# EAGLE design W5100_ethernet_shield (EAGLE 6.1)
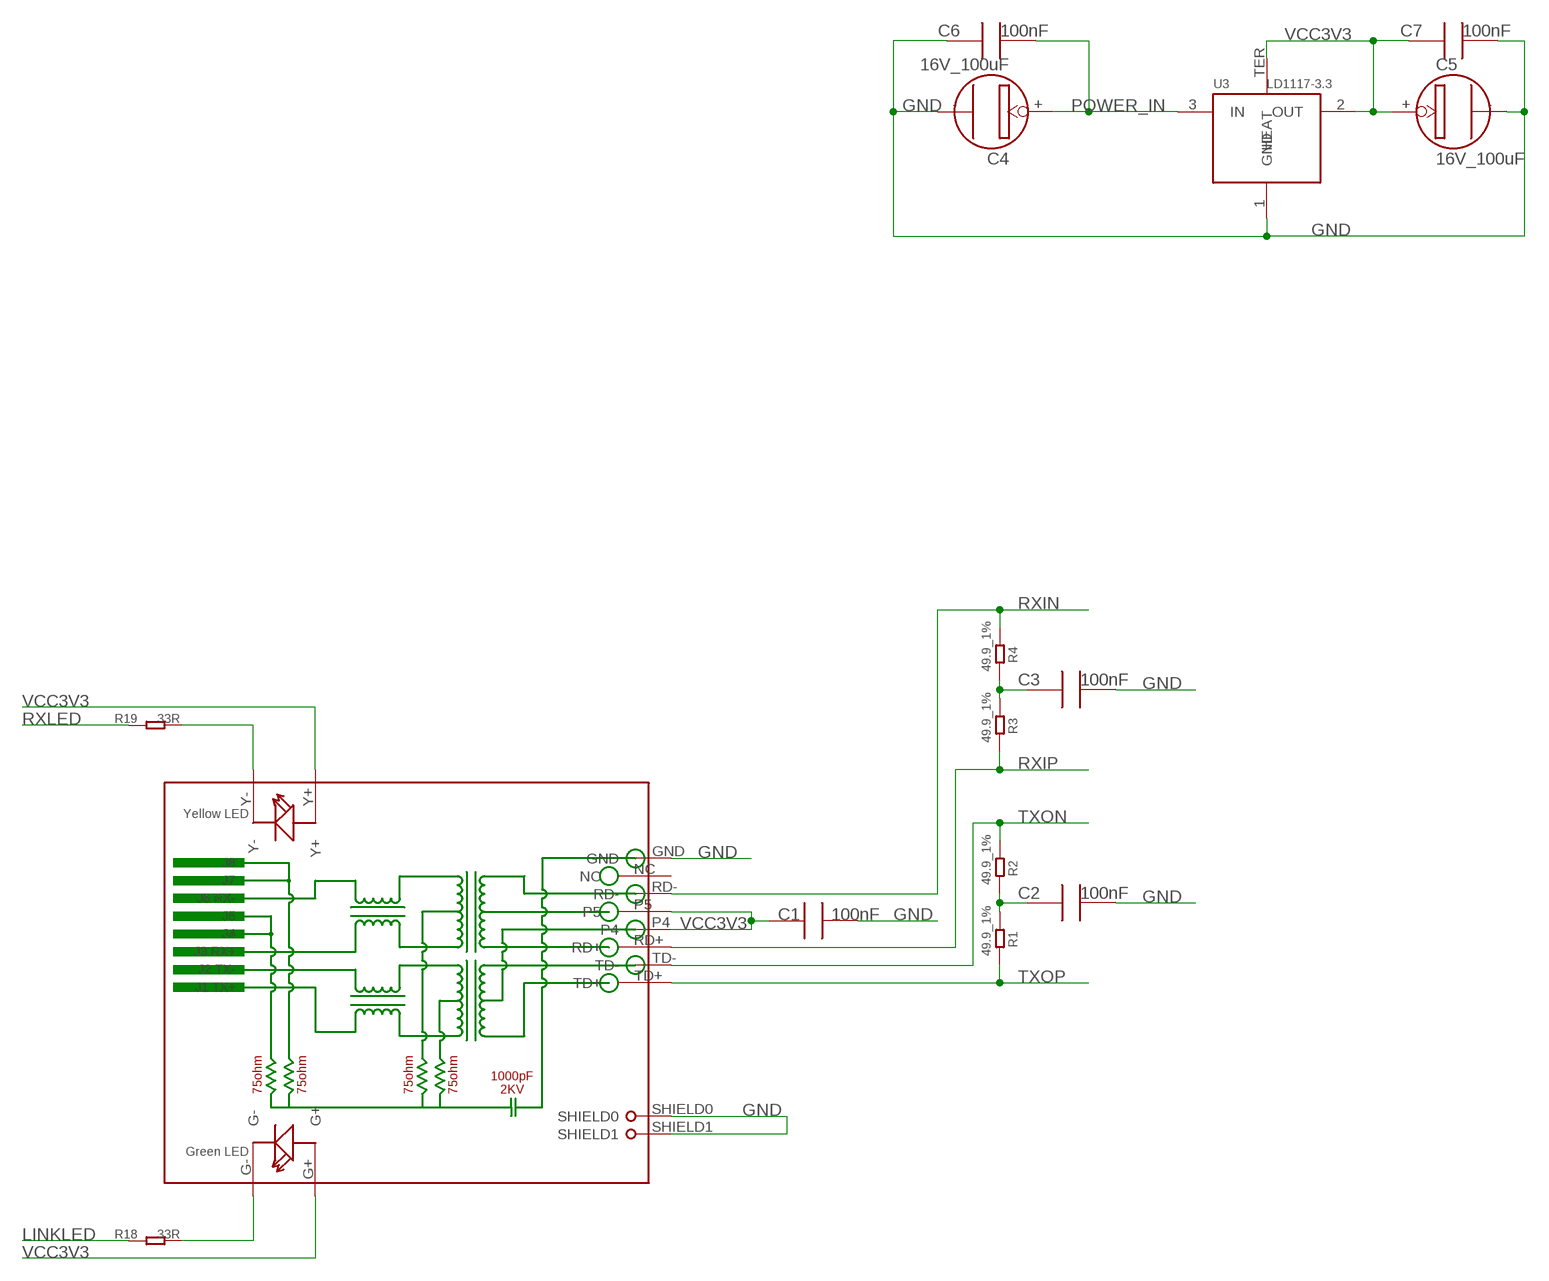
[diagram p0: schematic, sheet 1, part 1 of 2]
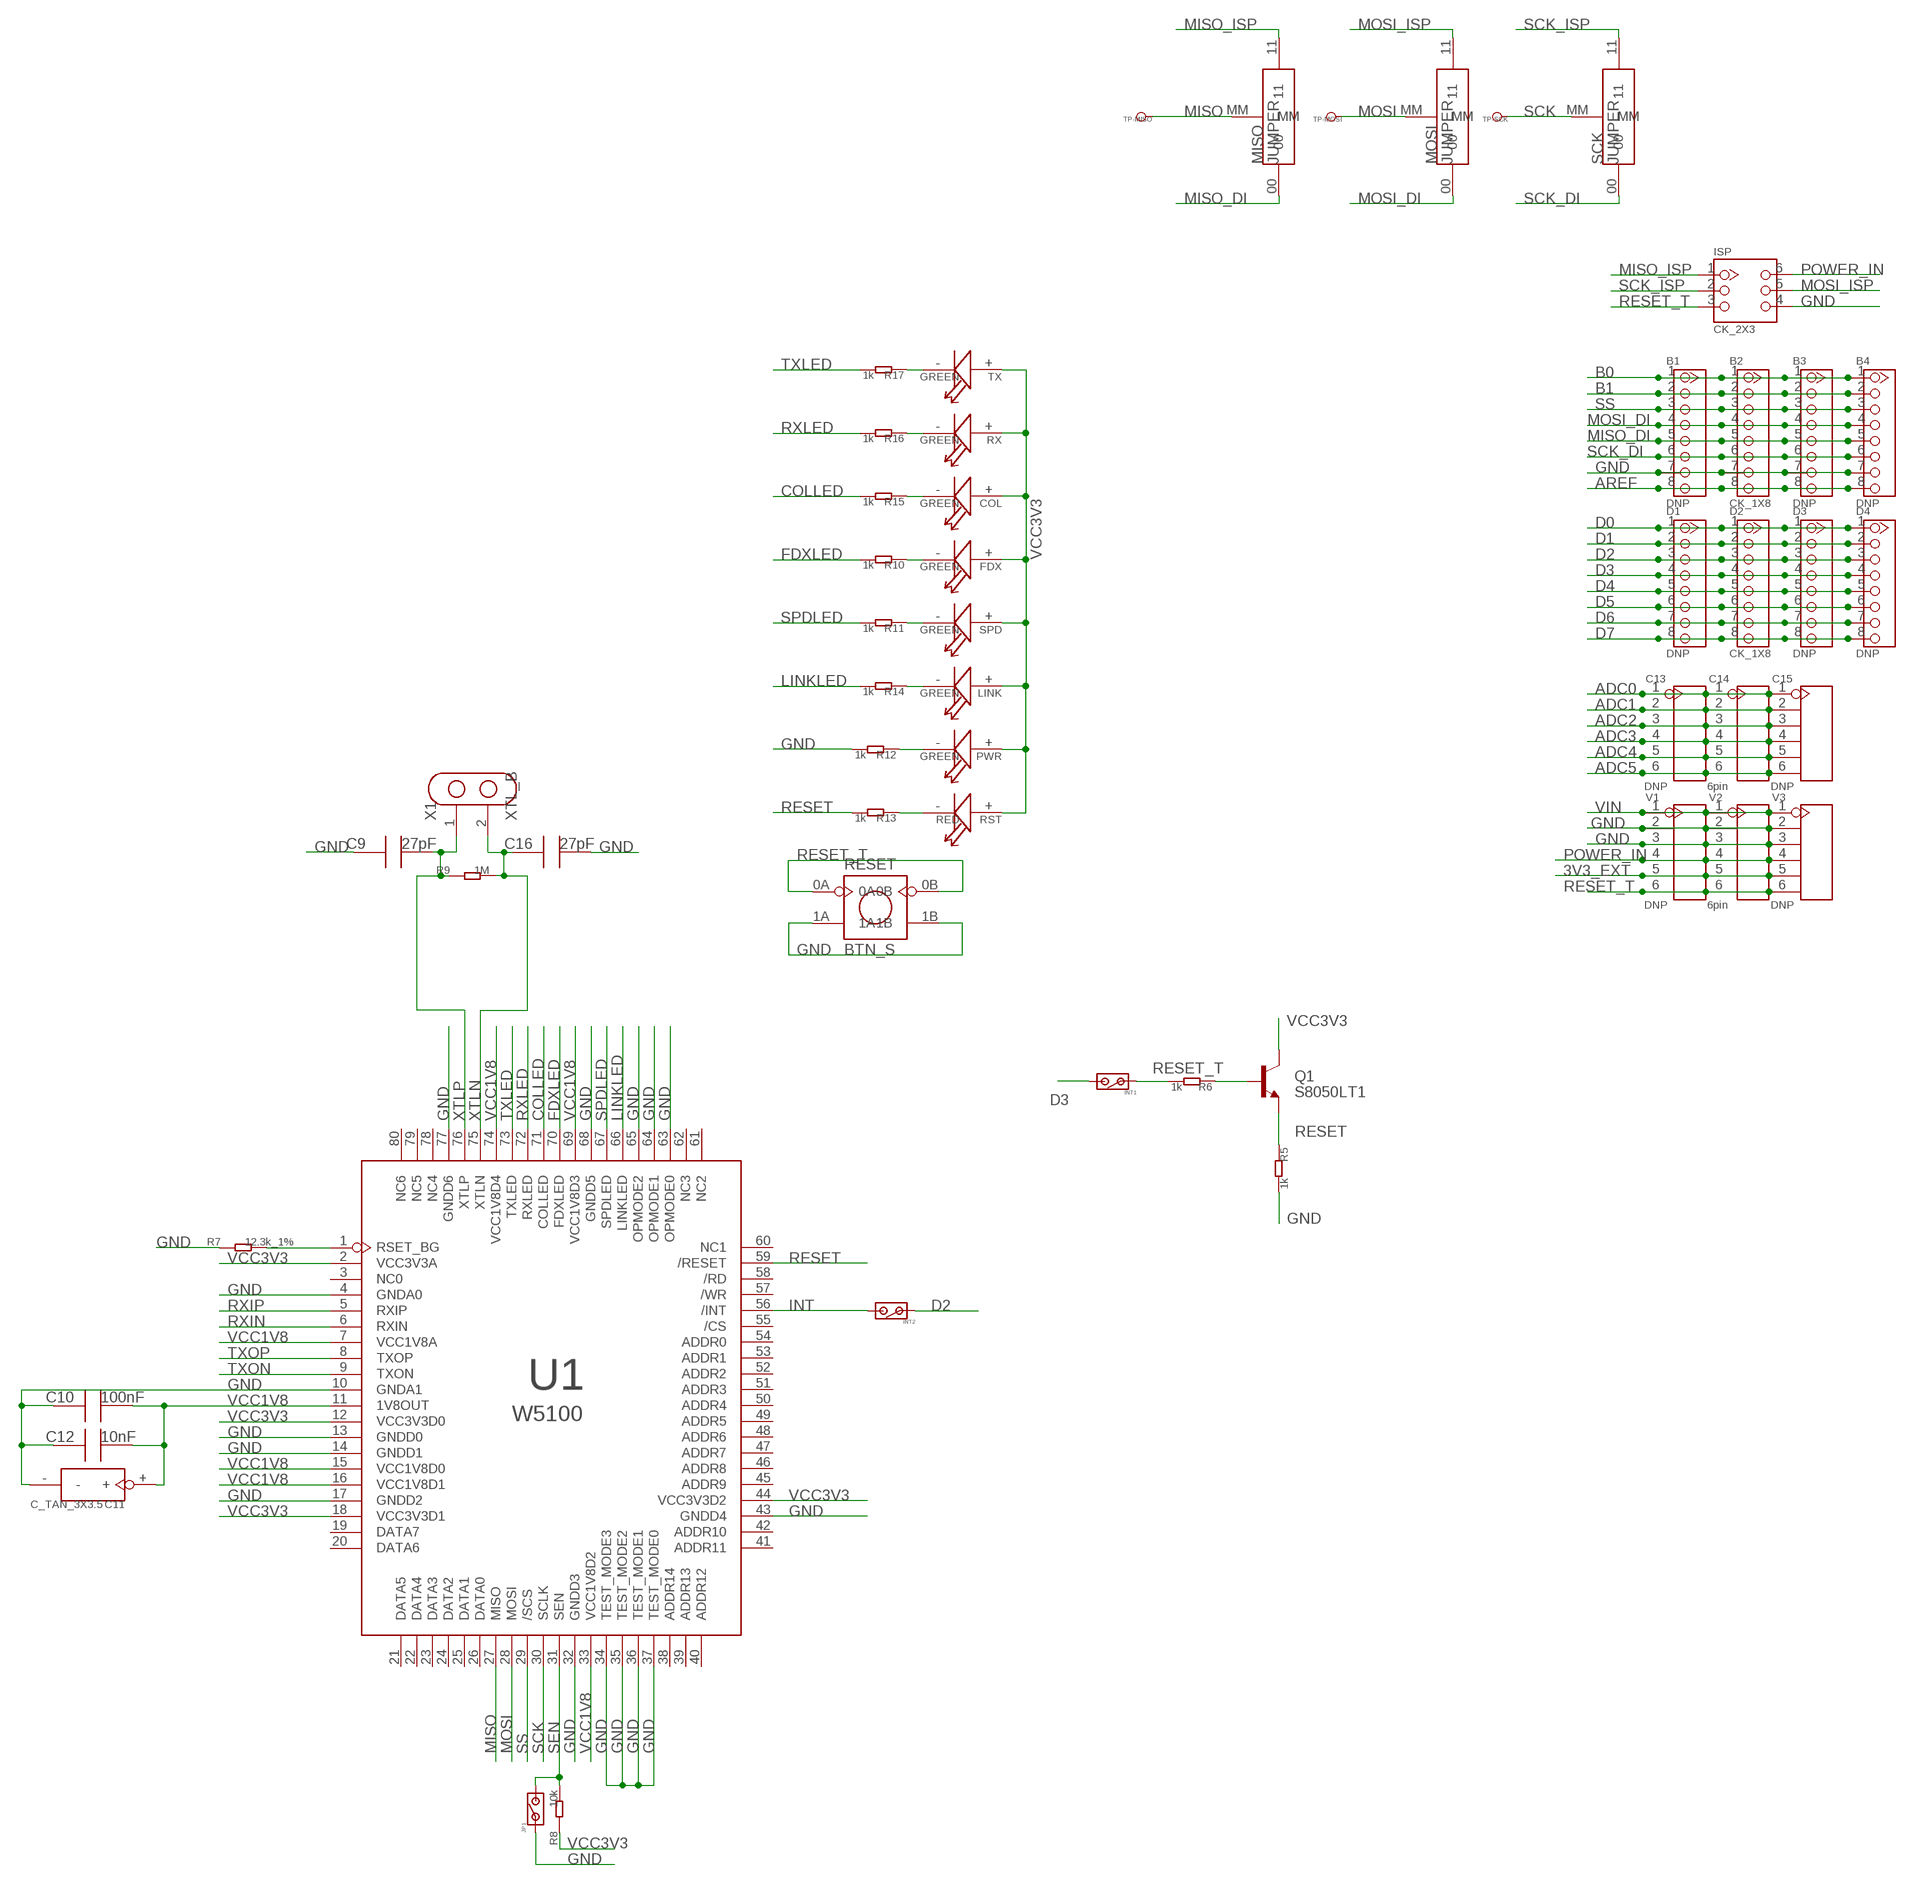
[diagram p1: schematic, sheet 1, part 2 of 2]

## Parts
B1  DNP  CK_1X8DD  [CK_1X8]
B2  CK_1X8  CK_1X8DD  [CK_1X8]
B3  DNP  CK_1X8DD  [CK_1X8]
B4  DNP  CK_1X8DD  [CK_1X8]
C1  100nF  C0603  [0603]
C2  100nF  C0603  [0603]
C3  100nF  C0603  [0603]
C4  16V_100uF  PANASONIC_D260  [SANYO-OSCON_SMD_C6]
C5  16V_100uF  PANASONIC_D260  [SANYO-OSCON_SMD_C6]
C6  100nF  C0603  [0603]
C7  100nF  C0603  [0603]
C9  27pF  C0603  [0603]
C10  100nF  C0603  [0603]
C11  C_TAN_3X3.5  [C_TAN_3X3.5]
C12  10nF  C0603  [0603]
C13  DNP  CK_16  [CK_1*6]
C14  6pin  CK_16  [CK_1*6]
C15  DNP  CK_16  [CK_1*6]
C16  27pF  C0603  [0603]
COL  GREEN  LED0805  [LED0805]
D1  DNP  CK_1X8DD  [CK_1X8]
D2  CK_1X8  CK_1X8DD  [CK_1X8]
D3  DNP  CK_1X8DD  [CK_1X8]
D4  DNP  CK_1X8DD  [CK_1X8]
FDX  GREEN  LED0805  [LED0805]
INT1  DNP  JP_SW  [JP_SW]
INT2  DNP  JP_SW  [JP_SW]
ISP  CK_2X3  [CK_2X3_THIN]
JP1  DNP  JP_SW  [JP_SW]
LINK  GREEN  LED0805  [LED0805]
MISO  JUMPER  [JUMPER]
MOSI  JUMPER  [JUMPER]
PWR  GREEN  LED0805  [LED0805]
Q1  S8050LT1  TRANSISTOR_NPNSOT23  [SOT23]
R1  49.9_1%  R0603  [0603]
R2  49.9_1%  R0603  [0603]
R3  49.9_1%  R0603  [0603]
R4  49.9_1%  R0603  [0603]
R5  1k  R0603  [0603]
R6  1k  R0603  [0603]
R7  12.3k_1%  R0603  [0603]
R8  10k  R0603  [0603]
R9  1M  R0603  [0603]
R10  1k  R0603  [0603]
R11  1k  R0603  [0603]
R12  1k  R0603  [0603]
R13  1k  R0603  [0603]
R14  1k  R0603  [0603]
R15  1k  R0603  [0603]
R16  1k  R0603  [0603]
R17  1k  R0603  [0603]
R18  33R  R0603  [0603]
R19  33R  R0603  [0603]
RESET  BTN_S  [BTN_S]
RJ1  HR911105A  [HR911105A]
RST  RED  LED0805  [LED0805]
RX  GREEN  LED0805  [LED0805]
SCK  JUMPER  [JUMPER]
SPD  GREEN  LED0805  [LED0805]
TP-MISO  DNP  PAD-TEST-POINT-CIRCLE'45X45'  [TP_45X45]
TP-MOSI  DNP  PAD-TEST-POINT-CIRCLE'45X45'  [TP_45X45]
TP-SCK  DNP  PAD-TEST-POINT-CIRCLE'45X45'  [TP_45X45]
TX  GREEN  LED0805  [LED0805]
U1  W5100  [SQFP80]
U3  LD1117-3.3  LD1117SOT223  [SOT223]
V1  DNP  CK_16  [CK_1*6]
V2  6pin  CK_16  [CK_1*6]
V3  DNP  CK_16  [CK_1*6]
X1  XTL_B  [XTL_B]

## Nets
3V3_EXT: V1.5 V2.5 V3.5
ADC0: C13.1 C14.1 C15.1
ADC1: C13.2 C14.2 C15.2
ADC2: C13.3 C14.3 C15.3
ADC3: C13.4 C14.4 C15.4
ADC4: C13.5 C14.5 C15.5
ADC5: C13.6 C14.6 C15.6
AREF: B1.8 B2.8 B3.8 B4.8
B0: B1.1 B2.1 B3.1 B4.1
B1: B1.2 B2.2 B3.2 B4.2
COLLED: R15.2 U1.71(COLLED)
D0: D1.1 D2.1 D3.1 D4.1
D1: D1.2 D2.2 D3.2 D4.2
D2: D1.3 D2.3 D3.3 D4.3 INT2.1
D3: D1.4 D2.4 D3.4 D4.4 INT1.2
D4: D1.5 D2.5 D3.5 D4.5
D5: D1.6 D2.6 D3.6 D4.6
D6: D1.7 D2.7 D3.7 D4.7
D7: D1.8 D2.8 D3.8 D4.8
FDXLED: R10.2 U1.70(FDXLED)
GND [power]: B1.7 B2.7 B3.7 B4.7 C1.2 C2.2 C3.2 C4.- C5.- C6.1 C7.2 C9.1 C10.1 C11.- C12.1 C16.2 ISP.4 JP1.1 R5.2 R7.1 R12.2 RESET.1A RESET.1B RJ1.GND RJ1.SHIELD0 RJ1.SHIELD1 U1.4(GNDA0) U1.10(GNDA1) U1.13(GNDD0) U1.14(GNDD1) U1.17(GNDD2) U1.32(GNDD3) U1.34(TEST_MODE3) U1.35(TEST_MODE2) U1.36(TEST_MODE1) U1.37(TEST_MODE0) U1.43(GNDD4) U1.63(OPMODE0) U1.64(OPMODE1) U1.65(OPMODE2) U1.68(GNDD5) U1.77(GNDD6) U3.1(GND) V1.2 V1.3 V2.2 V2.3 V3.2 V3.3
INT: INT2.2 U1.56(/INT)
LINKLED: R14.2 R18.1 U1.66(LINKLED)
MISO: MISO.MM TP-MISO.T U1.27(MISO)
MISO_DI: B1.5 B2.5 B3.5 B4.5 MISO.00
MISO_ISP: ISP.1 MISO.11
MOSI: MOSI.MM TP-MOSI.T U1.28(MOSI)
MOSI_DI: B1.4 B2.4 B3.4 B4.4 MOSI.00
MOSI_ISP: ISP.5 MOSI.11
N$1: C2.1 R1.1 R2.2
N$2: R19.2 RJ1.Y-
N$3: C3.1 R3.1 R4.2
N$4: R18.2 RJ1.G-
N$5: PWR.- R12.1
N$13: R13.1 RST.-
N$18: FDX.- R10.1
N$19: Q1.1(B) R6.1
N$24: R11.1 SPD.-
N$27: LINK.- R14.1
N$31: COL.- R15.1
N$35: R16.1 RX.-
N$38: R7.2 U1.1(RSET_BG)
N$39: R17.1 TX.-
POWER_IN: C4.+ C6.2 ISP.6 U3.3(IN) V1.4 V2.4 V3.4
RESET: Q1.2(E) R5.1 R13.2 U1.59(/RESET)
RESET_T: INT1.1 ISP.3 R6.2 RESET.0A RESET.0B V1.6 V2.6 V3.6
RXIN: R4.1 RJ1.RD- U1.6(RXIN)
RXIP: R3.2 RJ1.RD+ U1.5(RXIP)
RXLED: R16.2 R19.1 U1.72(RXLED)
SCK: SCK.MM TP-SCK.T U1.30(SCLK)
SCK_DI: B1.6 B2.6 B3.6 B4.6 SCK.00
SCK_ISP: ISP.2 SCK.11
SEN: JP1.2 R8.2 U1.31(SEN)
SPDLED: R11.2 U1.67(SPDLED)
SS: B1.3 B2.3 B3.3 B4.3 U1.29(/SCS)
TXLED: R17.2 U1.73(TXLED)
TXON: R2.1 RJ1.TD- U1.9(TXON)
TXOP: R1.2 RJ1.TD+ U1.8(TXOP)
VCC1V8: C10.2 C11.+ C12.2 U1.7(VCC1V8A) U1.11(1V8OUT) U1.15(VCC1V8D0) U1.16(VCC1V8D1) U1.33(VCC1V8D2) U1.69(VCC1V8D3) U1.74(VCC1V8D4)
VCC3V3: C1.1 C5.+ C7.1 COL.+ FDX.+ LINK.+ PWR.+ Q1.3(C) R8.1 RJ1.G+ RJ1.P4 RJ1.P5 RJ1.Y+ RST.+ RX.+ SPD.+ TX.+ U1.2(VCC3V3A) U1.12(VCC3V3D0) U1.18(VCC3V3D1) U1.44(VCC3V3D2) U3.2(OUT) U3.TER(HEAT)
VIN: V1.1 V2.1 V3.1
XTLN: C16.1 R9.2 U1.75(XTLN) X1.2
XTLP: C9.2 R9.1 U1.76(XTLP) X1.1
Unconnected: RJ1.NC U1.3(NC0) U1.19(DATA7) U1.20(DATA6) U1.21(DATA5) U1.22(DATA4) U1.23(DATA3) U1.24(DATA2) U1.25(DATA1) U1.26(DATA0) U1.38(ADDR14) U1.39(ADDR13) U1.40(ADDR12) U1.41(ADDR11) U1.42(ADDR10) U1.45(ADDR9) U1.46(ADDR8) U1.47(ADDR7) U1.48(ADDR6) U1.49(ADDR5) U1.50(ADDR4) U1.51(ADDR3) U1.52(ADDR2) U1.53(ADDR1) U1.54(ADDR0) U1.55(/CS) U1.57(/WR) U1.58(/RD) U1.60(NC1) U1.61(NC2) U1.62(NC3) U1.78(NC4) U1.79(NC5) U1.80(NC6)

## Library data of the parts
B1-B4 D1-D4 = CONNECTER:CK_1X8
C1-C3 C6 C7 C9 C10 C12 C16 = CPT_SMD:C0603; C0603: 100N
C4 C5 = CPT_SMD:PANASONIC_D
C11 = CPT_SMD:C_TAN
C13-C15 V1-V3 = CONNECTER:CK_1*6
COL FDX LINK PWR RST RX SPD TX = CPT_SMD:LED0805
INT1 INT2 JP1 = CPT_SMD:JP_SW
ISP = CONNECTER:CK_2X3
MISO MOSI SCK = CPT_SMD:JUMPER
Q1 = SparkFun2:TRANSISTOR_NPN: Transistor NPN BJT configuration in SOT23 package. MMBT2222 is the common NPN we use. Double check BCE configuration again layout.
R1-R19 = CPT_SMD:R0603
RESET = CPT_SMD:BTN_S
RJ1 = CONNECTER:HR911105A
TP-MISO TP-MOSI TP-SCK = Discrete:PAD-TEST-POINT-CIRCLE
U1 = ICs_v54:W5100
U3 = ICs_v54:LD1117
X1 = CPT_CJ:XTL_B

## Board
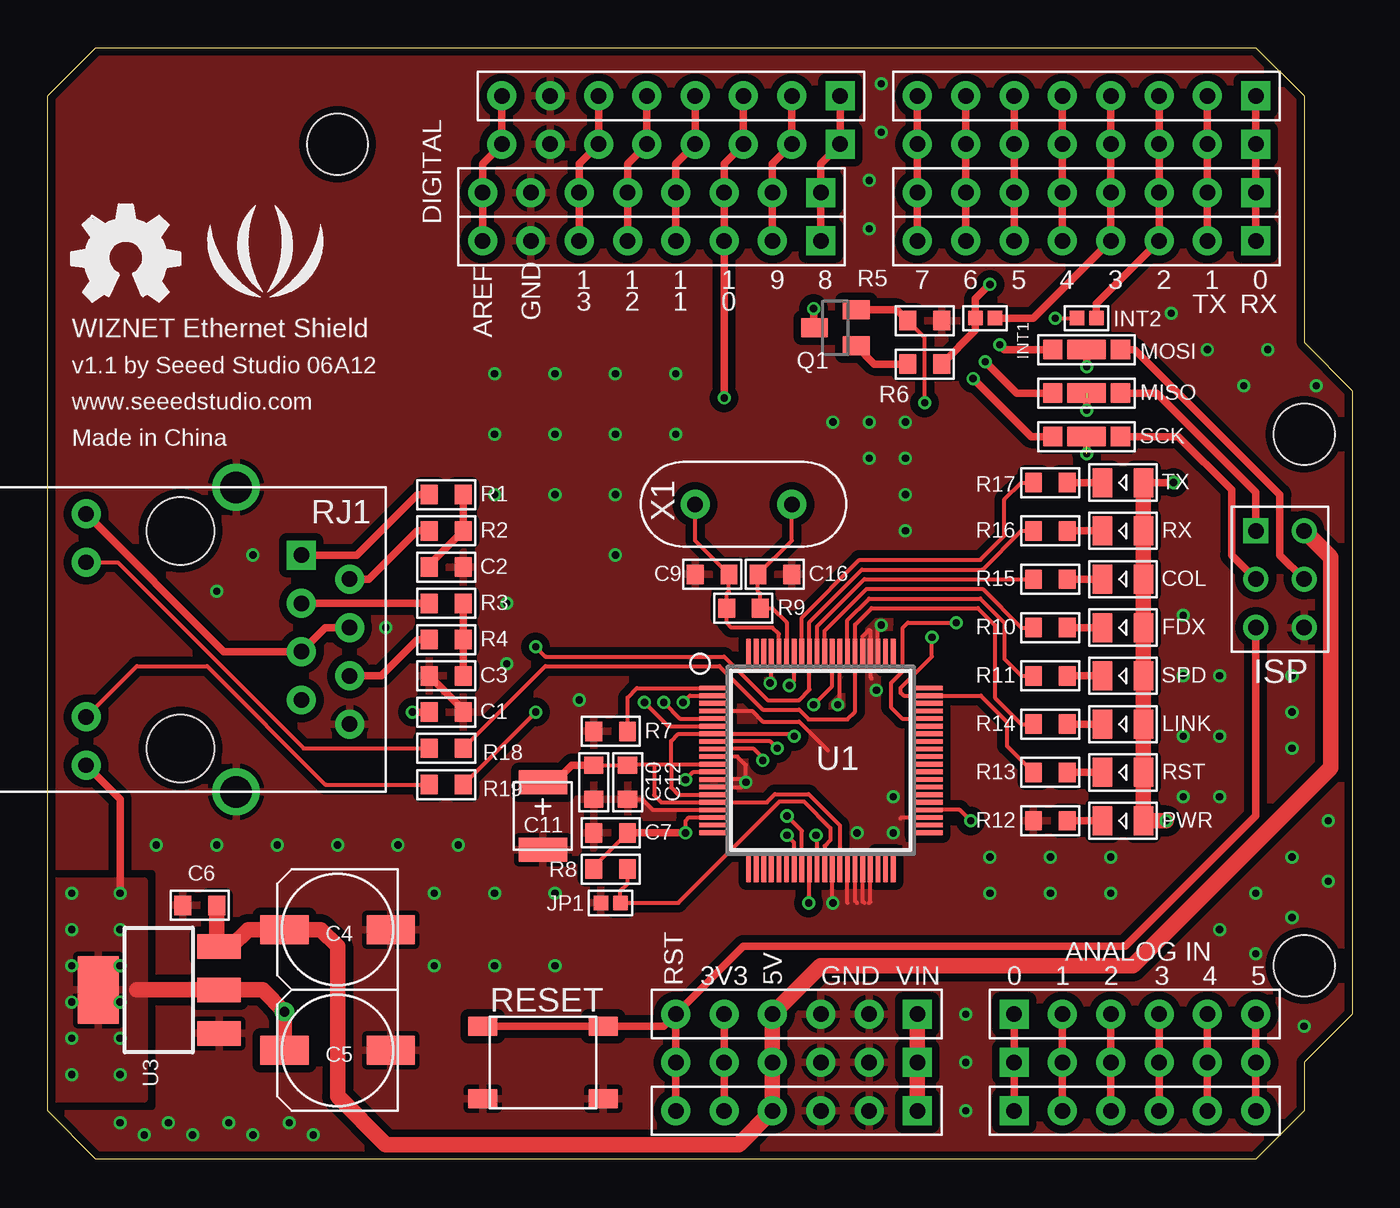
[diagram p2: board, top side]
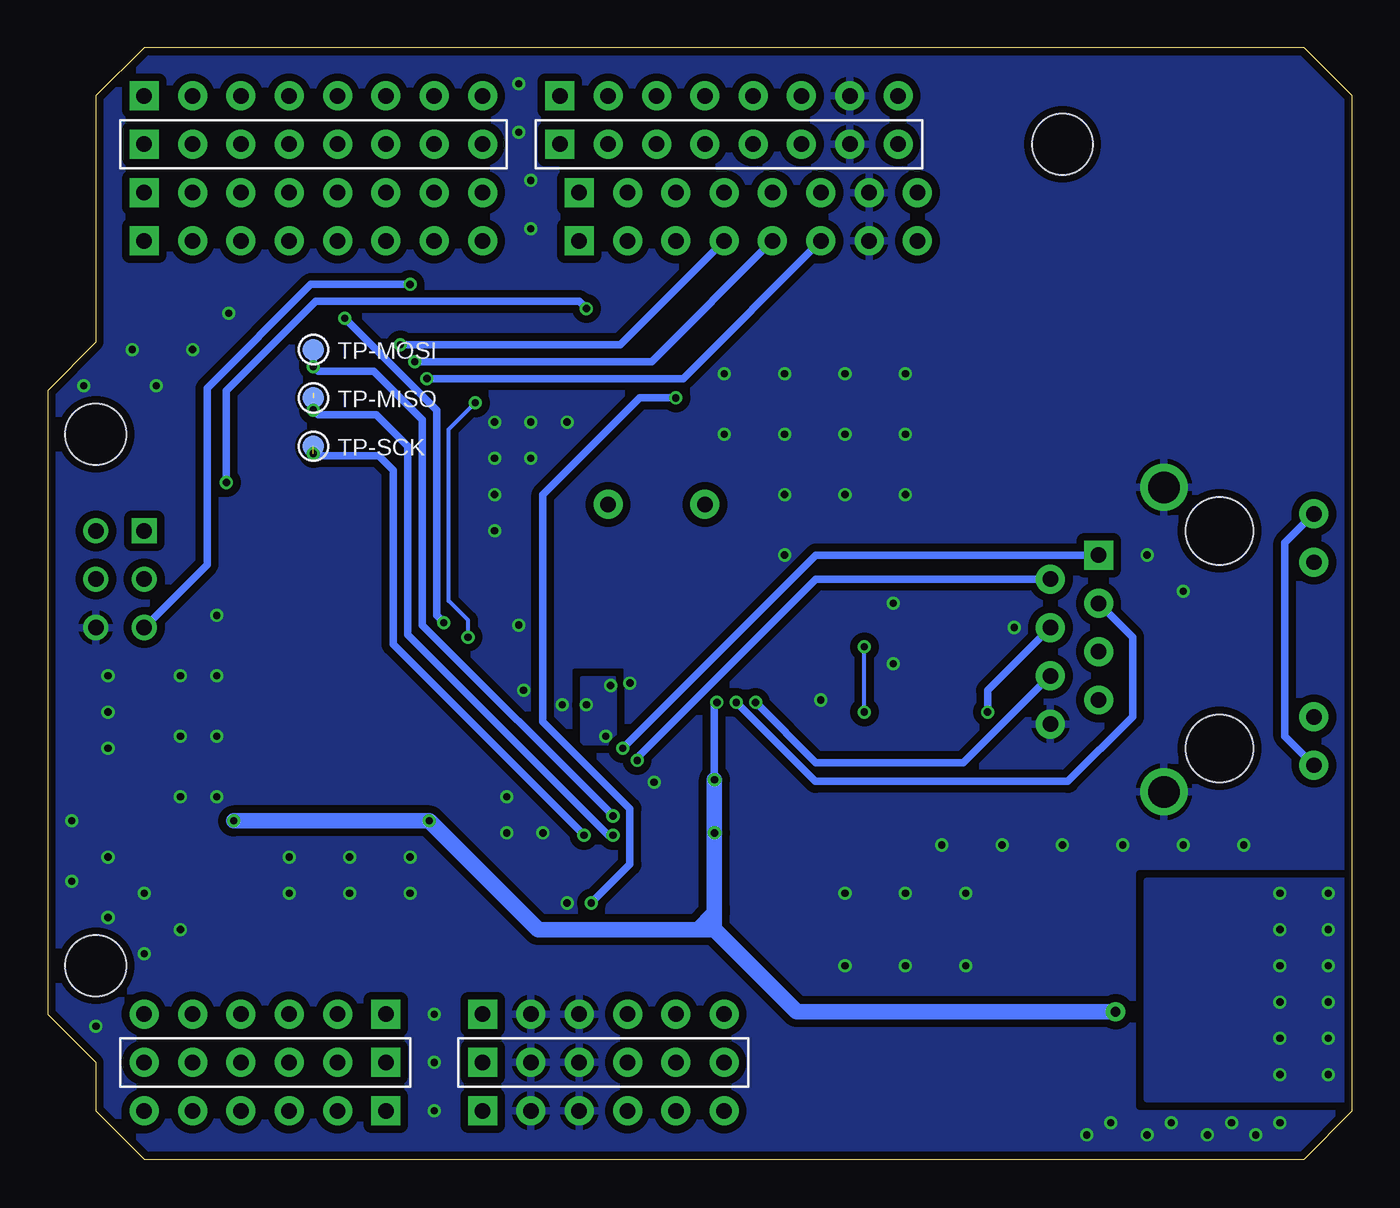
[diagram p3: board, bottom side, seen from below]

Size 68.58 x 58.42 mm. Coordinates in mm from the lower left corner, seen from the top.
Outline: 68.58,7.62 66.04,5.08 66.04,2.54 63.5,0 2.54,0 0,2.54 0,55.88 2.54,58.42 63.5,58.42 66.04,55.88 66.04,42.93 68.58,40.39 68.58,7.62
Copper layers (1*16): Top 0.035mm / dielectric 1.5mm / Bottom 0.035mm
Design rules: minimum track width 6mil, minimum drill 12mil, track to track 6mil, track to pad 6mil, pad to pad 6mil, via to via 6mil, smd to smd 0mil, copper to edge 10mil, drill to drill 10mil, minimum pad ring 10mil, minimum via ring 6mil, stop-mask expansion 2mil, vias tented up to drill 100mil, thermal gap 10mil
Holes 3.2 mm at 66.04,38.1 66.04,10.16 15.24,53.34
tRestrict: area 42,14.6 to 43.3,15.7

### Footprints (pad centres in the part's own frame; a part is rotated, then mirrored left to right if it is on the bottom)
CK_1X8 = drill 0.813 pad 1.524 square: 1 0,8.89 | drill 0.813 pad 1.524: 2 0,6.35; 3 0,3.81; 4 0,1.27; 5 0,-1.27; 6 0,-3.81; 7 0,-6.35; 8 0,-8.89
0603 = smd 0.889 x 1.016: 1 -0.889,0; 2 0.889,0
SANYO-OSCON_SMD_C6 = smd 2.54 x 1.524: + 2.794,0; - -2.794,0
C_TAN_3X3.5 = smd 2.54 x 1.27: + 0,1.778; - 0,-1.778
CK_1*6 = drill 0.813 pad 1.524 square: 1 0,6.35 | drill 0.813 pad 1.524: 2 0,3.81; 3 0,1.27; 4 0,-1.27; 5 0,-3.81; 6 0,-6.35
LED0805 = smd 1.016 x 1.524: + -1.077,0; - 1.077,0
JP_SW = smd 0.762 x 0.762: 1 0,0.508; 2 0,-0.508
CK_2X3_THIN = drill 0.813 pad 1.27 square: 1 -1.27,2.54 | drill 0.813 pad 1.27: 2 -1.27,0; 3 -1.27,-2.54; 4 1.27,-2.54; 5 1.27,0; 6 1.27,2.54
JUMPER = smd 1.016 x 1.016: 00 -1.778,0; 11 1.778,0 | smd 2.032 x 1.016: MM 0,0
SOT23 = smd 1 x 1.4: 1 -0.95,-1.1; 2 0.95,-1.1; 3 0,1.1
BTN_S = smd 1.524 x 1.016: 0A -3.175,1.905; 0B 3.175,1.905; 1A -3.175,-1.905; 1B 3.175,-1.905
HR911105A = drill 0.813 pad 1.524: G+ 4.953,-6.604; G- 4.953,-4.064; GND -8.89,4.445; NC -6.35,3.175; P4 -8.89,-0.635; P5 -6.35,0.635; RD+ -6.35,-1.905; RD- -8.89,1.905; TD- -8.89,-3.175; Y+ 4.953,6.604; Y- 4.953,4.064 | drill 1.651 pad 2.159: SHIELD0 -2.921,8.001; SHIELD1 -2.921,-8.001 | drill 0.813 pad 1.524 square: TD+ -6.35,-4.445 | hole 3.556: 0,-5.715; 0,5.715
TP_45X45 = smd 1.143 x 1.143: T 0,0
SQFP80 = smd 1.6 x 0.25: 1 -5.6,3.8; 2 -5.6,3.4; 3 -5.6,3; 4 -5.6,2.6; 5 -5.6,2.2; 6 -5.6,1.8; 7 -5.6,1.4; 8 -5.6,1; 9 -5.6,0.6; 10 -5.6,0.2; 11 -5.6,-0.2; 12 -5.6,-0.6; 13 -5.6,-1; 14 -5.6,-1.4; 15 -5.6,-1.8; 16 -5.6,-2.2; 17 -5.6,-2.6; 18 -5.6,-3; 19 -5.6,-3.4; 20 -5.6,-3.8; 41 5.6,-3.8; 42 5.6,-3.4; 43 5.6,-3; 44 5.6,-2.6; 45 5.6,-2.2; 46 5.6,-1.8; 47 5.6,-1.4; 48 5.6,-1; 49 5.6,-0.6; 50 5.6,-0.2; 51 5.6,0.2; 52 5.6,0.6; 53 5.6,1; 54 5.6,1.4; 55 5.6,1.8; 56 5.6,2.2; 57 5.6,2.6; 58 5.6,3; 59 5.6,3.4; 60 5.6,3.8 | smd 0.25 x 1.6: 21 -3.8,-5.6; 22 -3.4,-5.6; 23 -3,-5.6; 24 -2.6,-5.6; 25 -2.2,-5.6; 26 -1.8,-5.6; 27 -1.4,-5.6; 28 -1,-5.6; 29 -0.6,-5.6; 30 -0.2,-5.6; 31 0.2,-5.6; 32 0.6,-5.6; 33 1,-5.6; 34 1.4,-5.6; 35 1.8,-5.6; 36 2.2,-5.6; 37 2.6,-5.6; 38 3,-5.6; 39 3.4,-5.6; 40 3.8,-5.6; 61 3.8,5.6; 62 3.4,5.6; 63 3,5.6; 64 2.6,5.6; 65 2.2,5.6; 66 1.8,5.6; 67 1.4,5.6; 68 1,5.6; 69 0.6,5.6; 70 0.2,5.6; 71 -0.2,5.6; 72 -0.6,5.6; 73 -1,5.6; 74 -1.4,5.6; 75 -1.8,5.6; 76 -2.2,5.6; 77 -2.6,5.6; 78 -3,5.6; 79 -3.4,5.6; 80 -3.8,5.6
SOT223 = smd 1.27 x 2.286: 1 -2.286,-3.175; 2 0,-3.175; 3 2.286,-3.175 | smd 3.556 x 2.159: TER 0,3.175
XTL_B = drill 0.813 pad 1.524: 1 0,2.54; 2 0,-2.54

### Placement (x,y rotation side)
B1  32.77,55.88 270 top
B2  32.77,53.34 90 bottom
B3  31.75,50.8 270 top
B4  31.75,48.26 270 top
C1  20.95,23.5 0 top
C2  20.95,31.11 0 top
C3  20.95,25.4 180 top
C4  15.24,12.06 180 top
C5  15.24,5.71 180 top
C6  8,13.34 0 top
C7  29.59,17.14 180 top
C9  34.92,30.73 0 top
C10  28.7,19.81 90 top
C11  26.04,18.03 0 top
C12  30.48,19.81 90 top
C13  57.15,7.62 90 top
C14  57.15,5.08 270 bottom
C15  57.15,2.54 90 top
C16  38.23,30.73 0 top
COL  56.52,30.48 180 top
D1  54.61,55.88 270 top
D2  54.61,53.34 90 bottom
D3  54.61,50.8 270 top
D4  54.61,48.26 270 top
FDX  56.52,27.94 180 top
INT1  49.28,44.2 90 top
INT2  54.61,44.2 270 top
ISP  64.77,30.48 0 top
JP1  29.59,13.46 90 top
LINK  56.52,22.86 180 top
MISO  54.61,40.26 0 top
MOSI  54.61,42.55 0 top
PWR  56.52,17.78 180 top
Q1  41.4,43.69 90 top
R1  20.95,34.92 180 top
R2  20.95,33.02 0 top
R3  20.95,29.21 180 top
R4  20.95,27.3 0 top
R5  46.1,44.07 0 top
R6  46.1,41.78 0 top
R7  29.59,22.48 0 top
R8  29.59,15.24 0 top
R9  36.58,28.96 0 top
R10  52.7,27.94 180 top
R11  52.7,25.4 180 top
R12  52.7,17.78 180 top
R13  52.7,20.32 180 top
R14  52.7,22.86 180 top
R15  52.7,30.48 180 top
R16  52.7,33.02 180 top
R17  52.7,35.56 180 top
R18  20.95,21.59 180 top
R19  20.95,19.68 180 top
RESET  26.04,5.08 0 top
RJ1  6.99,27.3 180 top
RST  56.52,20.32 180 top
RX  56.52,33.02 180 top
SCK  54.61,37.97 0 top
SPD  56.52,25.4 180 top
TP-MISO  54.61,40.01 0 bottom
TP-MOSI  54.61,42.55 0 bottom
TP-SCK  54.61,37.47 0 bottom
TX  56.52,35.56 180 top
U1  40.64,20.95 0 top
U3  5.84,8.89 90 top
U$1  [OSHW_FILLX200_NOTEXT]  1.27,45.09 0 top
U$2  [LOGO_SILK]  11.43,46.99 0 top
V1  39.37,7.62 270 top
V2  39.37,5.08 90 bottom
V3  39.37,2.54 270 top
X1  36.58,34.42 90 top

### Tracks (layer width: path | path; a pad name or v marks a point on that pad's centre or on a via)
3V3_EXT
  Top 0.406: V1.5 V2.5 V3.5
ADC0
  Top 0.406: C15.1 C14.1 C13.1
ADC1
  Top 0.406: C13.2 C14.2 C15.2
ADC2
  Top 0.406: C15.3 C14.3 C13.3
ADC3
  Top 0.406: C13.4 C14.4 C15.4
ADC4
  Top 0.406: C15.5 C14.5 C13.5
ADC5
  Top 0.406: C13.6 C14.6 C15.6
AREF
  Top 0.406: B4.8 B3.8 22.86,52.32 B2.8 B1.8
B0
  Top 0.406: B4.1 B3.1 40.64,52.32 B2.1 B1.1
B1
  Top 0.406: B1.2 B2.2 38.1,52.32 B3.2 B4.2
COLLED
  Top 0.203: U1.71 40.44,27.99 42.93,30.48 R15.2
D0
  Top 0.406: D4.1 D3.1 D2.1 D1.1
D1
  Top 0.406: D1.2 D2.2 D3.2 D4.2
D2
  Top 0.406: D1.3 D2.3 D3.3 D4.3 55.12,44.96 INT2.1
D3
  Top 0.406: D1.4 D2.4 D3.4 D4.4 51.82,44.2 INT1.2
D4
  Top 0.406: D4.5 D3.5 D2.5 D1.5
D5
  Top 0.406: D1.6 D2.6 D3.6 D4.6
D6
  Top 0.406: D4.7 D3.7 D2.7 D1.7
D7
  Top 0.406: D1.8 D2.8 D3.8 D4.8
FDXLED
  Top 0.203: U1.70 40.84,27.76 43.05,29.97 49.15,29.97 51.18,27.94 R10.2
GND  (via drill 0.38)
  Top 0.203: U1.32 41.24,13.5 v41.27,13.46 | U1.4 37.02,23.55 37.59,22.99 39.5,22.99 41.02,21.46 | U1.77 38.04,25.09 v37.97,25.02 | U1.68 41.64,23.99 v41.53,23.88 | U1.10 36.25,21.16 36.7,20.7 v36.7,19.81 | U1.13 36.56,19.95 v36.7,19.81 | U1.14 36.45,19.55 v36.7,19.81 | U1.37 43.24,13.52 43.18,13.46 | U1.36 42.84,13.55 42.93,13.46 | U1.35 42.44,13.57 42.55,13.46 | U1.34 42.04,13.46 | U1.17 31.81,18.36 31.24,18.92 C12.1 | U1.43 44.88,17.95 44.83,17.91 | 43.31,25.27 43.24,25.34 U1.64 43.24,27.75 43.18,27.81 42.84,27.47 U1.65 | U1.63 43.64,27.89 v43.81,28.07
  Top 0.406: C1.2 21.84,23.62 C3.2
  other vias: 43.56,24.64 43.18,48.9 43.18,51.44 43.81,53.98 43.81,56.52 44.45,19.05 44.45,17.14 42.55,17.14 3.81,1.91 6.35,1.91 9.53,1.91 12.7,1.91 5.08,1.27 7.62,1.27 10.79,1.27 13.97,1.27 5.71,16.51 8.89,16.51 12.06,16.51 15.24,16.51 18.41,16.51 21.59,16.51 20.32,13.97 23.5,13.97 26.67,13.97 49.53,15.88 52.7,15.88 55.88,15.88 49.53,13.97 52.7,13.97 55.88,13.97 65.41,23.5 65.41,25.4 65.41,21.59 48.26,7.62 48.26,5.08 48.26,2.54 66.04,6.99 67.31,17.78 67.31,14.61 65.41,15.88 65.41,12.7 63.5,10.79 63.5,13.97 61.59,12.06 61.59,19.05 59.69,19.05 59.69,22.23 61.59,22.23 61.59,25.4 59.69,25.4 59.69,28.57 23.5,41.27 26.67,41.27 29.84,41.27 33.02,41.27 23.5,38.1 26.67,38.1 29.84,38.1 33.02,38.1 23.5,34.92 26.67,34.92 29.84,34.92 29.84,31.75 45.09,33.02 45.09,34.92 45.09,36.83 43.18,36.83 45.09,38.73 43.18,38.73 41.27,38.73 59.05,44.45 60.96,42.55 64.14,42.55 62.87,40.64 66.67,40.64 17.78,27.94 24.13,29.21 24.13,26.04 27.94,24.13 10.79,31.75 8.89,29.84 20.32,10.16 23.5,10.16 26.67,10.16
  pour Bottom (isolate 0.406, rank 6): 0,55.88 2.54,58.42 63.5,58.42 66.04,55.88 66.04,42.93 68.58,40.39 68.58,7.62 66.04,5.08 66.04,2.54 63.5,0 2.54,0 0,2.54
  pour Top (isolate 0.406, rank 6): 0,55.88 2.54,58.42 63.5,58.42 66.04,55.88 66.04,42.93 68.58,40.39 68.58,7.62 66.04,5.08 66.04,2.54 63.5,0 2.54,0 0,2.54
  pour Top: -13.97,51.44 -12.06,51.44 -12.06,50.16 -13.97,50.16
INT  (via drill 0.38)
  Top 0.203: v52.96,44.2 INT2.2 | U1.56 44.92,23.16 44.32,23.75 44.32,25.02 44.96,25.65 44.96,27.94 45.21,28.19 v47.75,28.19
  Bottom 0.406: v52.96,44.2 48.13,39.37 48.13,28.57 v47.75,28.19
LINKLED
  Top 0.203: R14.2 51.18,22.86 49.78,24.26 49.78,28.07 48.9,28.96 43.31,28.96 42.44,28.09 U1.66 42.44,23.52 42.04,23.11 40.01,23.11 39.5,23.62 37.59,23.62 35.31,25.91 26.16,25.91 R18.1
MISO  (via drill 0.38)  (1 unrouted)
  Top 0.203: U1.27 39.24,16.64 v38.86,17.02
  Top 0.406: v54.61,39.37 MISO.MM
  Bottom 0.406: v54.61,39.37 54.36,39.12 51.31,39.12 49.66,37.47 49.66,27.56 39.12,17.02 v38.86,17.02
MISO_DI  (via drill 0.38)
  Top 0.406: B4.5 B3.5 30.48,52.32 B2.5 B1.5 | MISO.00 50.93,40.26 v49.28,41.91
  Bottom 0.406: B4.5 36.83,41.91 v49.28,41.91
MISO_ISP
  Top 0.406: ISP.1 63.5,35.05 58.29,40.26 MISO.11
MOSI  (via drill 0.38)
  Top 0.203: U1.28 39.64,17.26 v38.86,18.03
  Top 0.406: TP-MOSI.T v54.61,41.66
  Bottom 0.406: TP-MOSI.T v54.61,41.66 54.36,41.4 51.44,41.4 48.9,38.86 48.9,28.07 v38.86,18.03
MOSI_DI  (via drill 0.38)
  Top 0.406: B4.4 B3.4 33.02,52.32 B2.4 B1.4 | MOSI.00 50.29,42.55 v50.04,42.8
  Bottom 0.406: B4.4 38.48,42.8 v50.04,42.8
MOSI_ISP
  Top 0.406: ISP.5 64.77,31.75 64.77,34.92 57.15,42.55 MOSI.11
N$1
  Top 0.406: R1.1 R2.2 20.07,31.24 C2.1
N$2
  Top 0.203: R19.2 14.61,19.68 8.38,25.91 4.7,25.91 RJ1.Y-
N$3
  Top 0.406: C3.1 R4.2 R3.1
N$4
  Top 0.203: R18.2 13.46,21.59 3.68,31.37 RJ1.G-
N$5
  Top 0.406: R12.1 PWR.-
N$13
  Top 0.406: RST.- R13.1
N$18
  Top 0.406: FDX.- R10.1
N$19
  Top 0.406: Q1.1 43.46,41.78 R6.1
N$24
  Top 0.406: SPD.- R11.1
N$27
  Top 0.406: LINK.- R14.1
N$31
  Top 0.406: COL.- R15.1
N$35
  Top 0.406: RX.- R16.1
N$38
  Top 0.203: U1.1 30.98,24.75 30.48,24.26 R7.2
N$39
  Top 0.406: TX.- R17.1
POWER_IN
  Top 0.813: ISP.6 67.44,31.62 67.44,20.57 57.02,10.16 40.64,10.16 V1.4 V2.4 V3.4 36.32,0.76 17.78,0.76 15.24,3.3 15.24,11.18 14.35,12.06 C4.+ 10.54,12.06 9.65,11.18 U3.3 | U3.3 8.38,11.18 | U3.3 8.85,11.34 8.89,11.38 C6.2
RESET  (via drill 0.38)
  Top 0.203: 46.35,24.36 U1.59 | 46.35,24.36 49.05,24.36 50.42,22.99 50.42,21.72 R13.2 | 42.42,44.7 42.55,44.58 44.7,44.58 R5.1 46.1,43.18 v46.1,39.75 | v46.48,27.43 46.48,26.42 44.83,24.77 44.83,24.51 44.99,24.36 46.35,24.36
  Top 0.406: R5.1 44.64,44.64 Q1.2
  Bottom 0.203: v46.1,39.75 47.5,38.35 47.5,29.34 46.48,28.32 v46.48,27.43
RESET_T  (via drill 0.38)
  Top 0.406: RESET.0A RESET.0B 32.38,6.99 V1.6 | V3.6 V2.6 V1.6 | R6.2 48.77,43.56 INT1.1 48.77,45.21 v49.53,45.97 | V1.6 36.58,11.18 56.64,11.18 63.5,18.03 ISP.3
  Bottom 0.406: v49.53,45.97 54.74,45.97 60.2,40.51 60.2,31.24 ISP.3
RXIN  (via drill 0.38)
  Top 0.203: U1.6 32.62,22.75 v31.37,24
  Top 0.406: RJ1.RD- 17.53,25.4 19.43,27.3 R4.1
  Bottom 0.406: RJ1.RD- 20.45,20.83 28.19,20.83 v31.37,24
RXIP  (via drill 0.38)
  Top 0.203: U1.5 33.23,23.16 v32.38,24
  Top 0.406: RJ1.RD+ R3.2
  Bottom 0.406: RJ1.RD+ 11.56,27.43 11.56,23.24 14.95,19.85 28.23,19.85 v32.38,24
RXLED  (via drill 0.38)
  Top 0.203: R16.2 51.18,33.02 49.15,30.99 42.8,30.99 40.04,28.23 U1.72 40.04,24.67 39.5,24.13 37.85,24.13 35.56,26.42 26.16,26.42 v25.65,26.92 | R19.1 v25.65,23.5
  Bottom 0.203: v25.65,23.5 v25.65,26.92
SCK  (via drill 0.38)  (1 unrouted)
  Top 0.203: U1.30 40.44,16.96 v40.39,17.02
  Top 0.406: v54.61,37.08 SCK.MM
  Bottom 0.406: v54.61,37.08 54.48,36.96 51.18,36.96 50.42,36.2 50.42,27.05 v40.39,17.02
SCK_DI  (via drill 0.38)
  Top 0.406: B4.6 B3.6 27.94,52.32 B2.6 B1.6 | SCK.00 51.69,37.97 v48.64,41.02
  Bottom 0.406: B4.6 35.18,41.02 v48.64,41.02
SCK_ISP
  Top 0.406: ISP.2 62.23,31.75 62.23,35.18 59.44,37.97 SCK.11
SEN
  Top 0.203: U1.31 40.84,16.46 41.15,16.76 41.15,17.4 39.75,18.8 38.48,18.8 33.15,13.46 JP1.2 30.1,14.1 30.48,14.48 R8.2
SPDLED
  Top 0.203: R11.2 51.18,25.4 50.29,26.29 50.29,28.19 49.02,29.46 43.18,29.46 42.04,28.32 U1.67
SS  (via drill 0.38)
  Top 0.203: U1.29 40.04,13.5 v40.01,13.46
  Top 0.406: B1.3 B2.3 35.56,52.32 B3.3 B4.3 v35.56,40.01
  Bottom 0.406: v40.01,13.46 37.97,15.49 37.97,18.41 42.55,22.99 42.55,34.92 37.47,40.01 v35.56,40.01
TXLED
  Top 0.203: U1.73 39.64,28.46 42.67,31.5 49.02,31.5 50.29,32.77 50.29,34.67 51.18,35.56 R17.2
TXON  (via drill 0.38)
  Top 0.203: U1.9 37.12,21.55 37.59,21.08 v37.59,20.95
  Top 0.406: RJ1.TD- 16.89,30.48 19.43,33.02 R2.1
  Bottom 0.406: RJ1.TD- 24.77,30.48 | 24.77,30.48 25.4,30.48 | v37.59,20.95 37.59,21.08 28.19,30.48 24.77,30.48
TXOP  (via drill 0.38)
  Top 0.203: U1.8 37.99,21.95 v38.35,21.59
  Top 0.406: RJ1.TD+ 16.26,31.75 19.43,34.92 R1.2
  Bottom 0.406: RJ1.TD+ 24.77,31.75 | 24.77,31.75 25.15,31.75 | v38.35,21.59 28.19,31.75 24.77,31.75
VCC1V8  (via drill 0.38)
  Top 0.203: 31.88,20.75 32.77,20.75 | 32.77,20.75 U1.11 | C10.2 C12.2 30.53,20.75 31.88,20.75 | 31.88,20.75 31.88,19.14 32.26,18.75 U1.16 37.8,18.75 38.23,19.18 40.01,19.18 41.64,17.54 U1.33 | 32.77,20.75 32.77,19.54 33.15,19.16 U1.15 | 32.77,20.75 32.77,21.97 33.15,22.36 U1.7 39.11,22.36 v39.24,22.23 | U1.74 39.24,25.14 v38.99,24.89 | U1.69 41.24,24.86 v40.26,23.88
  Top 0.406: C10.2 27.56,20.7 26.67,19.81 C11.+
  pour Bottom (isolate 0.406): 38.73,25.27 40.51,25.27 40.51,21.84 38.73,21.84
VCC3V3  (via drill 0.38, 0.51 pad 1.02)
  Top 0.203: U1.2 33.75,24.36 v33.4,24 | U1.12 33.94,20.36 v33.53,19.94 | U1.44 47.94,18.36 v48.51,17.78 | R8.1 28.7,15.37 C7.1 | U1.18 33.7,17.95 33.53,17.78 v33.53,17.14
  Top 0.406: RJ1.P4 14.61,27.94 RJ1.P5 9.27,26.67 RJ1.G+ | v19.18,23.5 C1.1 | RJ1.Y+ 3.81,18.92 v3.81,13.97 | v33.53,17.14 C7.1 | Q1.3 40.26,43.73 v40.26,44.7 | TX.+ v59.18,35.56
  Top 0.813: TX.+ RX.+ COL.+ FDX.+ SPD.+ LINK.+ RST.+ PWR.+ v58.8,17.78 | C5.+ v12.45,7.75 11.3,8.89 U3.2 4.7,8.89
  Bottom 0.406: v33.4,24 33.53,23.88 v33.53,19.94 | RJ1.P4 19.18,24.64 v19.18,23.5 | RJ1.Y+ 3.56,22.23 3.56,32.38 RJ1.G+ | v40.26,44.7 40.64,45.09 54.48,45.09 59.18,40.39 v59.18,35.56
  Bottom 0.813: v33.53,19.94 v33.53,17.14 33.53,13.21 | 33.53,12.06 34.29,12.06 | 33.53,12.06 34.42,12.06 | 34.42,12.06 42.8,12.06 v48.51,17.78 v58.8,17.78 | v12.45,7.75 29.21,7.75 33.91,12.45 33.78,12.45 33.53,12.19 | 33.53,12.19 33.53,13.21 | 33.53,12.19 33.53,12.06 | 33.53,13.21 33.53,12.95 34.42,12.06
  other vias: 1.27,13.97 1.27,12.06 3.81,12.06 3.81,10.16 1.27,10.16 1.27,8.26 3.81,8.26 1.27,6.35 3.81,6.35 3.81,4.45 1.27,4.45
  pour Top: -13.97,49.53 -12.06,49.53 -12.06,48.26 -13.97,48.26
  pour Top (isolate 0.406): 0,14.61 5.08,14.61 5.08,3.17 0,3.17
  pour Bottom (isolate 0.406): 0,14.61 10.79,14.61 10.79,3.17 0,3.17
VIN
  Top 0.813: V3.1 V2.1 V1.1
XTLN
  Top 0.203: U1.75 38.84,28.22 38.1,28.96 R9.2 37.47,29.72 37.34,29.84 C16.1 39.12,32.51 X1.2
XTLP
  Top 0.203: U1.76 38.44,27.6 38.1,27.94 35.94,27.94 35.69,28.19 R9.1 35.69,29.72 35.81,29.84 C9.2 34.04,32.51 X1.1

### Text on the board
tPlace: DIGITAL | 1 | 1 | 1 | 1 | 9 | 8 | 7 | 6 | 5 | 4 | 3 | 2 | 1 | 0 | 3 | 2 | 1 | 0 | TX | RX | GND | WIZNET Ethernet Shield | AREF | v1.1 by Seeed Studio 06A12 | www.seeedstudio.com | Made in China | ANALOG IN | RST | 3V3 | 5V | GND | VIN | 0 | 1 | 2 | 3 | 4 | 5
Reference: J7 | J8 | J9 | J10 | J11 | J12 | J13 | J14 | R5 | 1k | null | null | 33R | 1k | 33R | 33R | 1k | green | 49.9 | 49.9 | 1k | green | 100n | 27p | 27p | 1k | green | 49.9 | 1M | 49.9 | 1k | green | 100n | 1k | green | 100n | 12.3k | 1k | green | 33R | 1k | red | 33R | 10u | 100n | 10n | 100n | 1k | green | 10k | 100n | 100u | null | J1 | J2 | 100u | J3 | J4 | J5 | J6